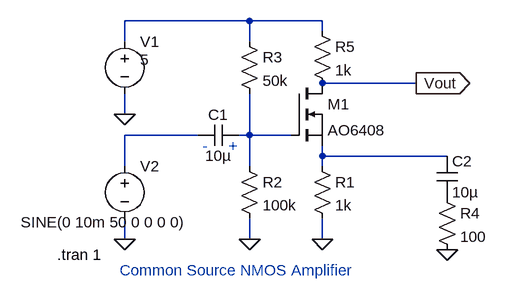
[diagram p0: schematic Draft2.asc]
Draft2.asc, the LTspice schematic file:
Version 4
SHEET 1 880 680
WIRE 144 -48 -48 -48
WIRE 256 -48 144 -48
WIRE 256 -32 256 -48
WIRE -48 -16 -48 -48
WIRE 144 -16 144 -48
WIRE 400 48 256 48
WIRE -48 96 -48 64
WIRE 64 128 -48 128
WIRE 144 128 144 64
WIRE 144 128 128 128
WIRE 208 128 144 128
WIRE 256 160 256 144
WIRE 448 160 256 160
WIRE -48 176 -48 128
WIRE 144 176 144 128
WIRE 256 176 256 160
WIRE -48 288 -48 256
WIRE 144 288 144 256
WIRE 256 288 256 256
FLAG -48 96 0
FLAG 144 288 0
FLAG 256 288 0
FLAG 400 48 Vout
IOPIN 400 48 Out
FLAG -48 288 0
FLAG 448 304 0
SYMBOL voltage -48 -32 R0
WINDOW 3 24 44 Left 2
WINDOW 123 0 0 Left 0
WINDOW 39 0 0 Left 0
SYMATTR Value 5
SYMATTR InstName V1
SYMBOL nmos 208 48 R0
SYMATTR InstName M1
SYMATTR Value AO6408
SYMBOL res 240 160 R0
SYMATTR InstName R1
SYMATTR Value 1k
SYMBOL res 128 160 R0
SYMATTR InstName R2
SYMATTR Value 100k
SYMBOL res 128 -32 R0
SYMATTR InstName R3
SYMATTR Value 50k
SYMBOL cap 128 112 R90
WINDOW 0 0 32 VBottom 2
WINDOW 3 32 32 VTop 2
SYMATTR InstName C1
SYMATTR Value 10µ
SYMBOL voltage -48 160 R0
WINDOW 3 -160 102 Left 2
WINDOW 123 0 0 Left 0
WINDOW 39 0 0 Left 0
SYMATTR Value SINE(0 10m 50 0 0 0 0)
SYMATTR InstName V2
SYMBOL res 432 208 R0
SYMATTR InstName R4
SYMATTR Value 100
SYMBOL cap 432 160 R0
SYMATTR InstName C2
SYMATTR Value 10µ
SYMBOL res 240 -48 R0
SYMATTR InstName R5
SYMATTR Value 1k
TEXT 112 144 Left 2 ;+
TEXT 72 144 Left 2 ;-
TEXT -152 312 Left 2 !.tran 1
TEXT -56 336 Left 2 ;Common Source NMOS Amplifier

The netlist it stands for:
* Draft2.asc
V1 N001 0 5
M1 Vout N003 N004 N004 AO6408
R1 N004 0 1k
R2 N003 0 100k
R3 N001 N003 50k
C1 N003 N002 10µ
V2 N002 0 SINE(0 10m 50 0 0 0 0)
R4 P001 0 100
C2 N004 P001 10µ
R5 N001 Vout 1k
.model NMOS NMOS
.model PMOS PMOS
.lib standard.mos
* +
* -
.tran 1
* Common Source NMOS Amplifier
.backanno
.end